# Altium project SensCon.PrjPCB
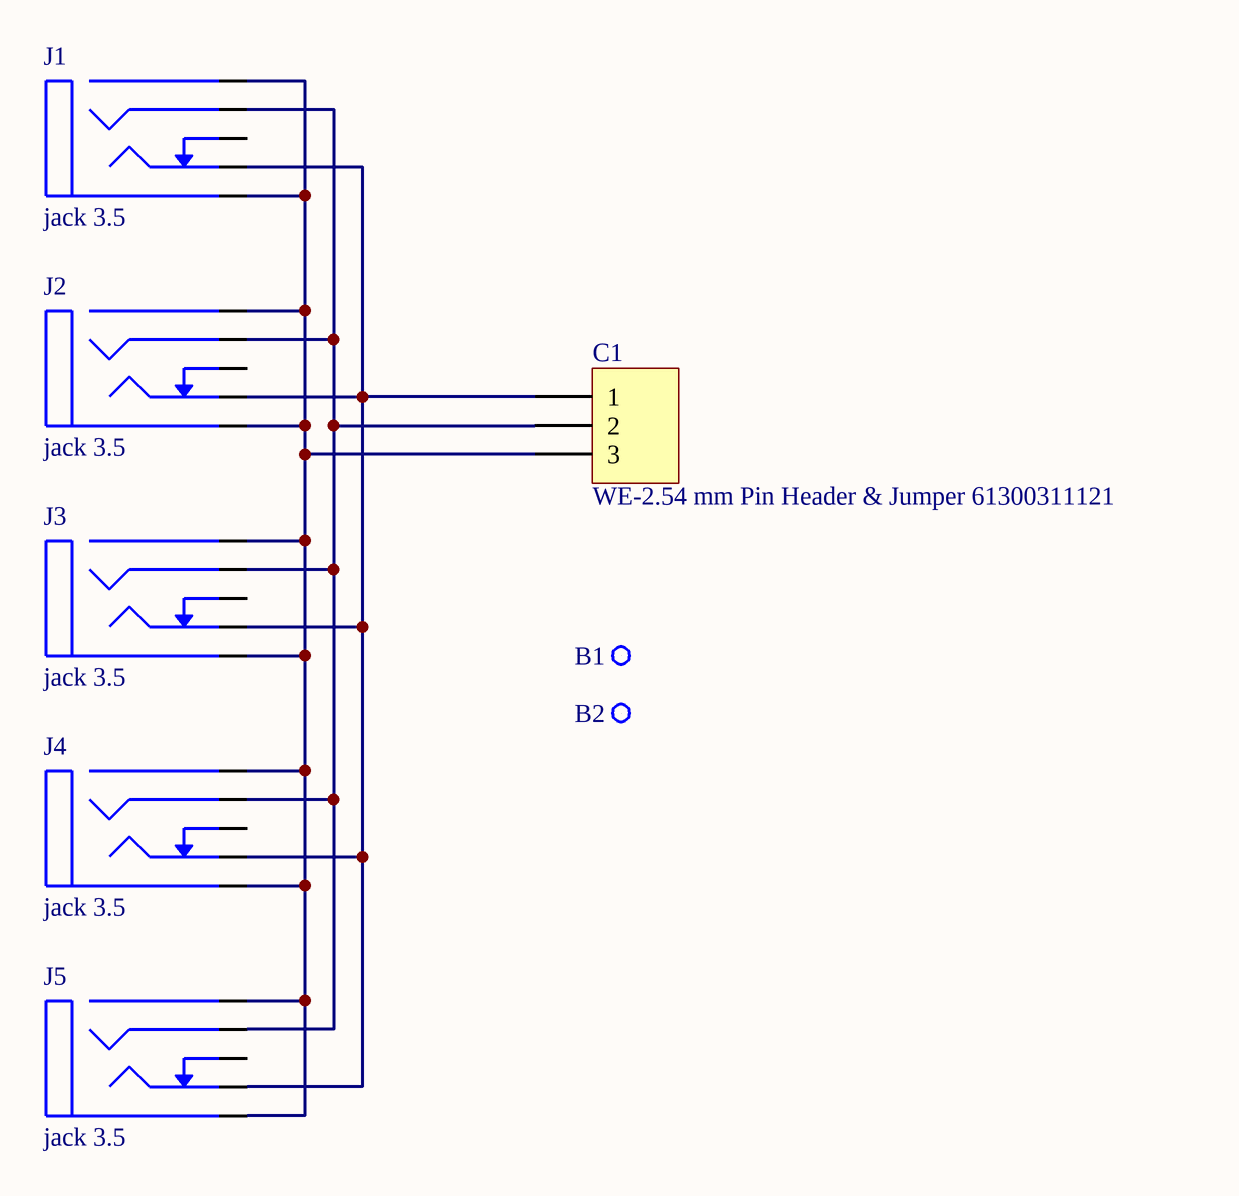
[diagram p0: SensorsConnectorBrd.SchDoc]
1 sheet, 8 parts. Net scope: global (net labels, ports and power ports of the same name join across sheets).
Board file: SensorsConnectorBrd.PcbDoc

## Sheet SensorsConnectorBrd.SchDoc
size A4

### Parts
B1  Non Plated Hole  [MTG300]  (value not drawn)
B2  Non Plated Hole  [MTG300]  (value not drawn)
C1  WE-2.54 mm Pin Header & Jumper 61300311121  [61300311121]
J1  jack 3.5  [Jak-Ph St 6x14]
J2  jack 3.5  [Jak-Ph St 6x14]
J3  jack 3.5  [Jak-Ph St 6x14]
J4  jack 3.5  [Jak-Ph St 6x14]
J5  jack 3.5  [Jak-Ph St 6x14]

### Nets
NetC1_1: C1.1 J1.4 J2.4 J3.4 J4.4 J5.4
NetC1_2: C1.2 J1.3 J2.3 J3.3 J4.3 J5.3
NetC1_3: C1.3 J1.1(G1) J1.2(G) J2.1(G1) J2.2(G) J3.1(G1) J3.2(G) J4.1(G1) J4.2(G) J5.1(G1) J5.2(G)

Not connected (* = marked no-connect by the designer): B1 1; B2 1; J1 5; J2 5; J3 5; J4 5; J5 5

### Library data of the parts
B1 B2 = NON-PLATED_HOLE3.0: Single Terminal Socket; Part Description: Non Plated Through Hole: Hole Dia.=3.0mm; Mounted: No; Table: Pads; Part Number: NON-PLATED_HOLE3.0; Component Kind: Standard (No BOM); Component Type: Standard (No BOM); Pin Count: 1; Family: Non Plated Hole; Socket: No; SMD: No; Status: None; ComponentHeight: 0mm; Author: CERN DEM JLC; CreateDate: 26.05.2008; LatestRevisionDate: 26.05.2008; PackageDescription: Non Plated Through Hole: Hole Dia.=3.0mm
C1 = WE-2.54 mm Pin Header & Jumper 61300311121: WR-PHD 2.54mm Pin Header; Manufacturer: WЁ№rth Elektronik eiSos GmbH; ComponentLink1 Description: Manufacturer; ComponentLink2 Description: Datasheet; NoPins: 03; Created Date: 22 March 2013; partNo: 61300311121; ComponentLink1URL: http://www.we-online.com; ComponentLink2URL: http://katalog.we-online.de/em/datasheet/6130xx11121.pdf; Created by: Karrer Zheng